# EAGLE design sensors (EAGLE 7.6.0)
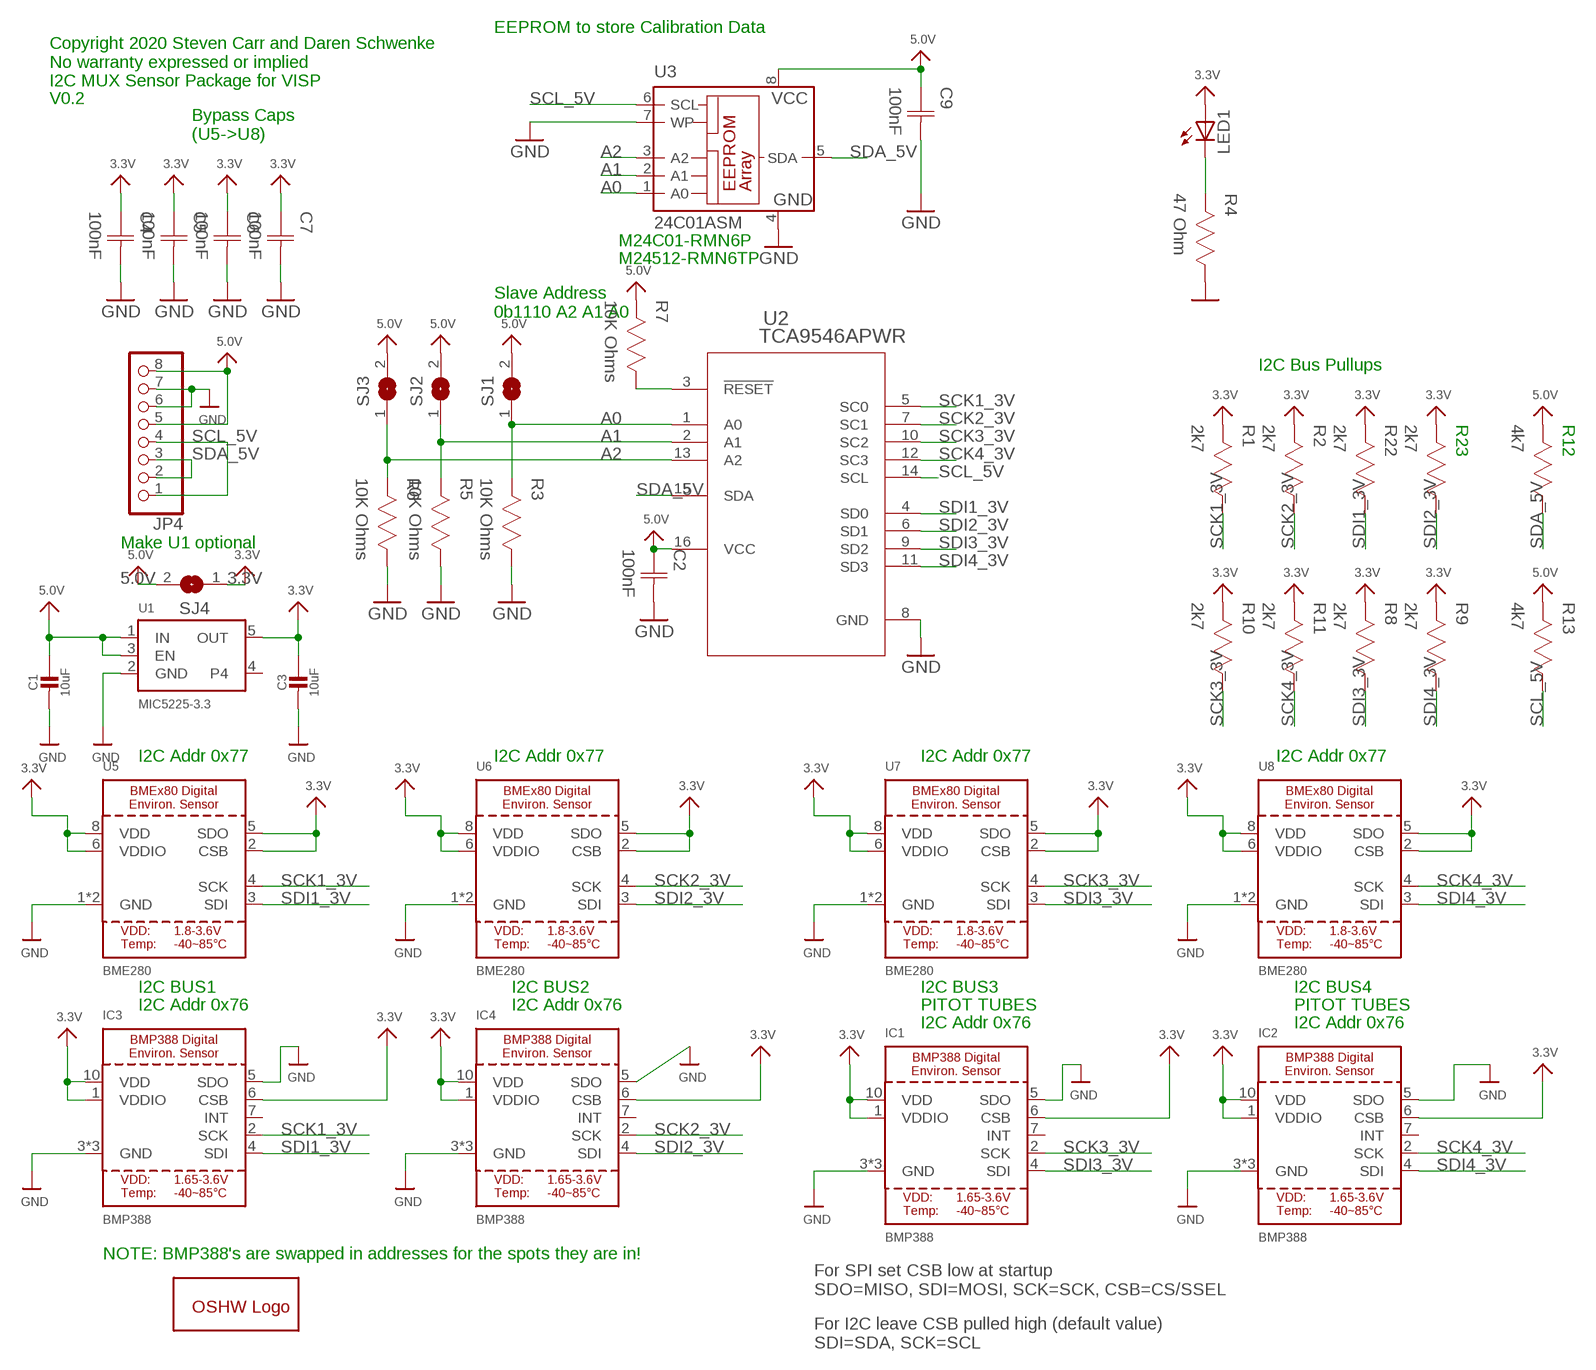
[diagram p0: schematic, sheet 1]

## Parts
C1  10uF  CAP_CERAMIC_0805  [_0805]
C2  100nF  CAPACITOR-0402  [CAP0402]
C3  10uF  CAP_CERAMIC_0805  [_0805]
C4  100nF  CAPACITOR-0402  [CAP0402]
C5  100nF  CAPACITOR-0402  [CAP0402]
C6  100nF  CAPACITOR-0402  [CAP0402]
C7  100nF  CAPACITOR-0402  [CAP0402]
C9  100nF  CAPACITOR-0402  [CAP0402]
GOLD_ORB_SM1  OSHWLOGOLOGO8MM  [OSHW_8MM]
IC1  BMP388  [BMP388]
IC2  BMP388  [BMP388]
IC3  BMP388  [BMP388]
IC4  BMP388  [BMP388]
JP4  PINHD-1X08_2.54  [1X08]
LED1  LEDCHIP-LED0603  [CHIP-LED0603]
R1  2k7  RESISTOR-0402  [RES0402]
R2  2k7  RESISTOR-0402  [RES0402]
R3  10K Ohms  RESISTOR-0402  [RES0402]
R4  47 Ohm  RESISTOR-0402  [RES0402]
R5  10K Ohms  RESISTOR-0402  [RES0402]
R6  10K Ohms  RESISTOR-0402  [RES0402]
R7  10K Ohms  RESISTOR-0402  [RES0402]
R8  2k7  RESISTOR-0402  [RES0402]
R9  2k7  RESISTOR-0402  [RES0402]
R10  2k7  RESISTOR-0402  [RES0402]
R11  2k7  RESISTOR-0402  [RES0402]
R12  4k7  RESISTOR-0402  [RES0402]
R13  4k7  RESISTOR-0402  [RES0402]
R22  2k7  RESISTOR-0402  [RES0402]
R23  2k7  RESISTOR-0402  [RES0402]
SJ1  SJ  [SJ]
SJ2  SJ  [SJ]
SJ3  SJ  [SJ]
SJ4  SJ  [SJ]
U1  MIC5225-3.3  VREG_SOT23-5  [SOT23-5]
U2  TCA9546APWR  [PW16]
U3  24C01ASM  [SO-08M]
U5  BME280  [BME280]
U6  BME280  [BME280]
U7  BME280  [BME280]
U8  BME280  [BME280]

## Nets
3.3V: C3.1 C4.1(C1) C5.1(C1) C6.1(C1) C7.1(C1) IC1.1(VDDIO) IC1.6(CSB) IC1.10(VDD) IC2.1(VDDIO) IC2.6(CSB) IC2.10(VDD) IC3.1(VDDIO) IC3.6(CSB) IC3.10(VDD) IC4.1(VDDIO) IC4.6(CSB) IC4.10(VDD) LED1.A R1.2 R2.2 R8.2 R9.2 R10.2 R11.2 R22.2 R23.2 SJ4.1 U1.5(OUT) U5.2(CSB) U5.5(SDO) U5.6(VDDIO) U5.8(VDD) U6.2(CSB) U6.5(SDO) U6.6(VDDIO) U6.8(VDD) U7.2(CSB) U7.5(SDO) U7.6(VDDIO) U7.8(VDD) U8.2(CSB) U8.5(SDO) U8.6(VDDIO) U8.8(VDD)
5.0V: C1.1 C2.1(C1) C9.1(C1) JP4.5 JP4.8 R7.2 R12.2 R13.2 SJ1.2 SJ2.2 SJ3.2 SJ4.2 U1.1(IN) U1.3(EN) U2.16(VCC) U3.8(VCC)
A0: R3.2 SJ1.1 U2.1(A0) U3.1(A0)
A1: R5.2 SJ2.1 U2.2(A1) U3.2(A1)
A2: R6.2 SJ3.1 U2.13(A2) U3.3(A2)
GND: C1.2 C2.2(C2) C3.2 C4.2(C2) C5.2(C2) C6.2(C2) C7.2(C2) C9.2(C2) IC1.3(GND) IC1.5(SDO) IC1.8(GND) IC1.9(GND) IC2.3(GND) IC2.5(SDO) IC2.8(GND) IC2.9(GND) IC3.3(GND) IC3.5(SDO) IC3.8(GND) IC3.9(GND) IC4.3(GND) IC4.5(SDO) IC4.8(GND) IC4.9(GND) JP4.6 JP4.7 R3.1 R4.1 R5.1 R6.1 U1.2(GND) U2.8(GND) U3.4(GND) U3.7(WP) U5.1(GND) U5.7(GND) U6.1(GND) U6.7(GND) U7.1(GND) U7.7(GND) U8.1(GND) U8.7(GND)
LED: LED1.C R4.2
RESET: R7.1 U2.3(!RESET)
SCK1_3V: IC3.2(SCK) R1.1 U2.5(SC0) U5.4(SCK)
SCK2_3V: IC4.2(SCK) R2.1 U2.7(SC1) U6.4(SCK)
SCK3_3V: IC1.2(SCK) R10.1 U2.10(SC2) U7.4(SCK)
SCK4_3V: IC2.2(SCK) R11.1 U2.12(SC3) U8.4(SCK)
SCL_5V: JP4.1 JP4.4 R13.1 U2.14(SCL) U3.6(SCL)
SDA_5V: JP4.2 JP4.3 R12.1 U2.15(SDA) U3.5(SDA)
SDI1_3V: IC3.4(SDI) R22.1 U2.4(SD0) U5.3(SDI)
SDI2_3V: IC4.4(SDI) R23.1 U2.6(SD1) U6.3(SDI)
SDI3_3V: IC1.4(SDI) R8.1 U2.9(SD2) U7.3(SDI)
SDI4_3V: IC2.4(SDI) R9.1 U2.11(SD3) U8.3(SDI)
Unconnected: IC1.7(INT) IC2.7(INT) IC3.7(INT) IC4.7(INT) U1.4

## Notes on the sheet
- EEPROM to store Calibration Data
- Copyright 2020 Steven Carr and Daren Schwenke
  No warranty expressed or implied
  I2C MUX Sensor Package for VISP
- V0.2
- Bypass Caps
  (U5->U8)
- M24C01-RMN6P
- M24512-RMN6TP
- Slave Address
  0b1110 A2 A1 A0
- I2C Bus Pullups
- Make U1 optional
- I2C Addr 0x77 | I2C Addr 0x77 | I2C Addr 0x77 | I2C Addr 0x77
- I2C BUS1 | I2C BUS2 | I2C BUS3 | I2C BUS4
- I2C Addr 0x76 | I2C Addr 0x76 | PITOT TUBES | PITOT TUBES
- I2C Addr 0x76 | I2C Addr 0x76
- NOTE: BMP388's are swapped in addresses for the spots they are in!
- For SPI set CSB low at startup
  SDO=MISO, SDI=MOSI, SCK=SCK, CSB=CS/SSEL
- For I2C leave CSB pulled high (default value)
  SDI=SDA, SCK=SCL

## Library data of the parts
C1 C3 = microbuilder:CAP_CERAMIC: Ceramic Capacitors For new designs, use the packages preceded by an '_' character since they are more reliable: The following footprints should be used on most boards: _0402 - Standard footprint for regular board layouts _0603 - Standard footprint for regular board layouts _0805 - Standard footprint for regular board layouts _1206 - Standard footprint for regular board layouts For extremely tight-pitch boards where space is at a premium, the following 'micro-pitch' footprints can be used (smaller pads, no silkscreen outline, etc.): _0402MP - Micro-pitch footprint for very dense/compact boards _0603MP - Micro-pitch footprint for very dense/compact boards _0805MP - Micro-pitch footprint for very dense/compact boards _1206MP - Micro-pitch footprint for very dense/compact boards; MPN: C1608X5R1A106M080AC
C2 C9 = Capacitor:CAPACITOR; MPN: CL10B104KB8NNNC
C4-C7 = Capacitor:CAPACITOR; MPN: CL10F104ZO8NNNC
GOLD_ORB_SM1 = oshw:OSHWLOGO: The OSHW logo for PCB layout
IC1-IC4 = microbuilder:BMP388; MPN: BMP388
JP4 = pinhead-2:PINHD-1X08: PIN HEADER
LED1 = led:LED: LED OSRAM: - CHIPLED LG R971, LG N971, LY N971, LG Q971, LY Q971, LO R971, LY R971 LH N974, LH R974 LS Q976, LO Q976, LY Q976 LO Q996 - Hyper CHIPLED LW Q18S LB Q993, LB Q99A, LB R99A - SideLED LS A670, LO A670, LY A670, LG A670, LP A670 LB A673, LV A673, LT A673, LW A673 LH A674 LY A675 LS A676, LA A676, LO A676, LY A676, LW A676 LS A679, LY A679, LG A679 - Hyper Micro SIDELED® LS Y876, LA Y876, LO Y876, LY Y876 LT Y87S - SmartLED LW L88C, LW L88S LB L89C, LB L89S, LG L890 LS L89K, LO L89K, LY L89K LS L896, LA L896, LO L896, LY L896 - TOPLED LS T670, LO T670, LY T670, LG T670, LP T670 LSG T670, LSP T670, LSY T670, LOP T670, LYG T670 LG T671, LOG T671, LSG T671 LB T673, LV T673, LT T673, LW T673 LH T674 LS T676, LA T676, LO T676, LY T676, LB T676, LH T676, LSB T676, LW T676 LB T67C, LV T67C, LT T67C, LS T67K, LO T67K, LY T67K, LW E67C LS E67B, LA E67B, LO E67B, LY E67B, LB E67C, LV E67C, LT E67C LW T67C LS T679, LY T679, LG T679 LS T770, LO T770, LY T770, LG T770, LP T770 LB T773, LV T773, LT T773, LW T773 LH T774 LS E675, LA E675, LY E675, LS T675 LS T776, LA T776, LO T776, LY T776, LB T776 LHGB T686 LT T68C, LB T68C - Hyper Mini TOPLED® LB M676 - Mini TOPLED Santana® LG M470 LS M47K, LO M47K, LY M47K Source: http://www.osram.convergy.de LUXEON: - LUMILED® LXK2-PW12-R00, LXK2-PW12-S00, LXK2-PW14-U00, LXK2-PW14-V00 LXK2-PM12-R00, LXK2-PM12-S00, LXK2-PM14-U00 LXK2-PE12-Q00, LXK2-PE12-R00, LXK2-PE12-S00, LXK2-PE14-T00, LXK2-PE14-U00 LXK2-PB12-K00, LXK2-PB12-L00, LXK2-PB12-M00, LXK2-PB14-N00, LXK2-PB14-P00, LXK2-PB14-Q00 LXK2-PR12-L00, LXK2-PR12-M00, LXK2-PR14-Q00, LXK2-PR14-R00 LXK2-PD12-Q00, LXK2-PD12-R00, LXK2-PD12-S00 LXK2-PH12-R00, LXK2-PH12-S00 LXK2-PL12-P00, LXK2-PL12-Q00, LXK2-PL12-R00 Source: www.luxeon.com KINGBRIGHT: KA-3528ASYC Source: www.kingbright.com; MPN: SML-D12P8WT86
R1-R3 R5-R13 R22 R23 = Resistor:RESISTOR; MPN: CRCW060310K0FKEAC
R4 = Resistor:RESISTOR; MPN: RC0603FR-0747RL
SJ1-SJ4 = jumper:SJ: SMD solder JUMPER
U1 = microbuilder:VREG_SOT23-5: SOT23-5 Fixed Voltage Regulators Part Current Out V Out V In V Dropout θJA (°C/W) TJ (°C) Digikey Part No. ADP121 150mA 3.3V 3.4-5.5V 0.09V @ 150mA -- -- ADP121-AUJZ33R7CT-ND ADP121 150mA 3.0V 3.1-5.5V 0.09V @ 150mA -- -- ADP121-AUJZ30R7CT-ND ADP122 300mA 3.3V 3.4-5.5V 0.085V @ 300mA -- -- ADP122AUJZ-3.3-R7CT-ND ADP1712 300mA 3.3V 3.5-5.5V 0.17V @ 300mA -- -- ADP1712AUJZ-3.3-R7TR-ND AP7311 (Low Cost) 150mA 3.3V 3.5-6V 0.15V @ 150mA -- -- AP7311-33WG-7DICT-ND LD39015M18R 150mA 1.8V 1.9V-5.5V 0.08V @ 100mA -- -- 497-6977-1-ND LP2985A-33DBVR 150mA 3.3V 3.3-16V 0.28V @ 150mA 206 150 296-18479-1-ND MCP1824T-3302E/OT 300mA 3.3V 3.5V-6V 0.2V @ 300mA -- -- MCP1824T-3302E/OTCT-ND MIC5205-2.5YM5 TR 150mA 2.5V 2.7-16V 0.165V @ 150mA -- -- 576-1257-2-ND MIC5205-3.0YM5 TR 150mA 3.0V 3.2V-16V 0.165V @ 150mA -- -- 576-1258-2-ND MIC5205-3.3YM5 TR 150mA 3.3V 3.5V-16V 0.165V @ 150mA -- -- 576-1259-2-ND TPS780330220 150mA 3.3V+2.2V 3.6-5.5V 250mV Max -- -- 296-23332-1-ND TDA3663/N1,135 100mA 3.3V 3.5-45V 0.18V @ 50mA -- -- 568-5343-1-ND Max operating temp can be calculated using θJA, TJ (max junction temperature), and power in watts. Set the "Maximum Ambient Temperature" until it reaches TJ ("Max Junction Temperature"), which is the absolute limit for safe use of the regulator: Heat Sink Temperature Calculator <http://www.daycounter.com/Calculators/Heat-Sink-Temperature-Calculator.phtml> For example, With 12V source into a 3.3V LP2985 and a 30mA load, we are dissipating (12V-3.3V) * 0.03A = 0.261W. With a θJA of 206 °C/W, a TJ of 150°C, and 261mW we can safely use the chip without a heat sink up to 75°C (=147.1°C Junction Temperature).; MPN: MIC5225-3.3YM5-TR
U2 = TCA9546A:TCA9546APWR; BUILT_BY: EMA_UL_Team; MANUFACTURER_PART_NUMBER: TCA9546APWR; VENDOR: Texas Instruments
U3 = microchip:24*: Serial EEPROM I2C; MF: MICROCHIP; MPN: M24C01-RMN6P
U5-U8 = microbuilder:BME280: BME280 - Environmental Sensor (I2C + SPI)

## Board
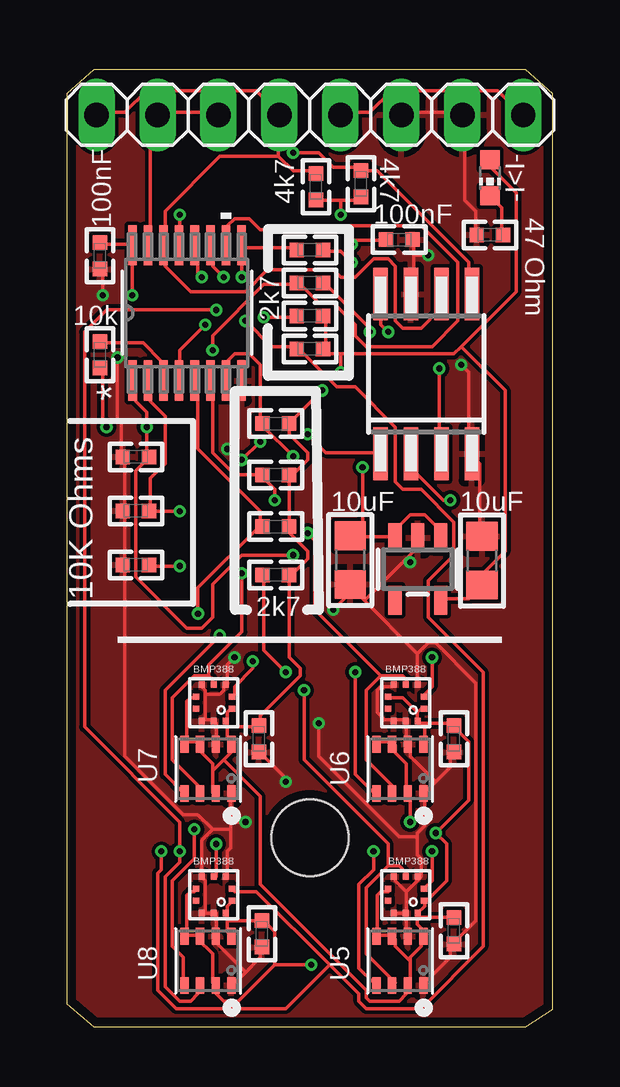
[diagram p1: board, top side]
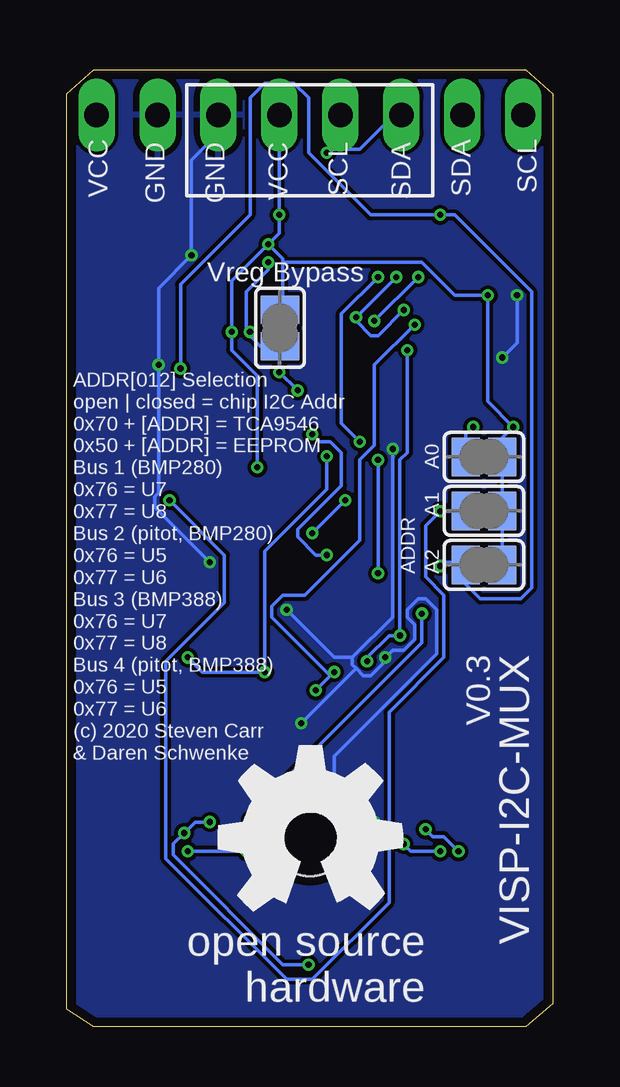
[diagram p2: board, bottom side, seen from below]

Size 20.25 x 39.88 mm. Coordinates in mm from the lower left corner, seen from the top.
Outline: 1.12,39.88 0,38.88 0,0.95 1.12,0 19.12,0 20.25,0.72 20.25,38.88 19.12,39.88 1.12,39.88
Copper layers (1*16): Top 0.035559375mm / dielectric 1.6mm / Bottom 0.035559375mm
Design rules "oshpark-2layer *": minimum track width 6mil, minimum drill 10mil, track to track 6mil, track to pad 6mil, pad to pad 6mil, via to via 6mil, smd to smd 6mil, copper to edge 15mil, drill to drill 6mil, minimum pad ring 6mil, minimum via ring 5mil, stop-mask expansion 2.5mil, vias tented up to drill 13mil, thermal gap 10mil
Holes 3.2 mm at 10.12,7.88
vRestrict: area 4.4,2.3 to 7.8,5.7; area 12.4,2.3 to 15.8,5.7; area 4.4,10.3 to 7.8,13.7; area 12.4,10.3 to 15.8,13.7

### Footprints (pad centres in the part's own frame; a part is rotated, then mirrored left to right if it is on the bottom)
_0805 = smd 1.2 x 1.3: 1 -1.016,0; 2 1.016,0
CAP0402 = smd 0.6 x 0.6: 1 -0.55,0; 2 0.55,0
BMP388 = smd 0.25 x 0.275: 1 0.25,0.75; 2 -0.25,0.75; 6 -0.25,-0.75; 7 0.25,-0.75 | smd 0.275 x 0.25: 3 -0.762,0.5; 4 -0.762,0; 5 -0.762,-0.5; 8 0.762,-0.5; 9 0.762,0; 10 0.762,0.5
1X08 = drill 1.016 long: 1 -8.89,0; 2 -6.35,0; 3 -3.81,0; 4 -1.27,0; 5 1.27,0; 6 3.81,0; 7 6.35,0; 8 8.89,0
CHIP-LED0603 = smd 0.8 x 0.8: A 0,-0.75; C 0,0.75
RES0402 = smd 0.6 x 0.6: 1 -0.55,0; 2 0.55,0
SJ = smd 1.168 x 1.6: 1 -0.762,0; 2 0.762,0
SOT23-5 = smd 0.55 x 1.2: 1 -0.95,-1.3; 2 0,-1.3; 3 0.95,-1.3; 4 0.95,1.3; 5 -0.95,1.3
PW16 = smd 1.676 x 0.356: 1 -2.819,2.275; 2 -2.819,1.625; 3 -2.819,0.975; 4 -2.819,0.325; 5 -2.819,-0.325; 6 -2.819,-0.975; 7 -2.819,-1.625; 8 -2.819,-2.275; 9 2.819,-2.275; 10 2.819,-1.625; 11 2.819,-0.975; 12 2.819,-0.325; 13 2.819,0.325; 14 2.819,0.975; 15 2.819,1.625; 16 2.819,2.275
SO-08M = smd 0.6 x 2.2: 1 -1.905,-3.33; 2 -0.635,-3.33; 3 0.635,-3.33; 4 1.905,-3.33; 5 1.905,3.33; 6 0.635,3.33; 7 -0.635,3.33; 8 -1.905,3.33
BME280 = smd 0.7 x 0.35: 1 1.025,0.975; 2 1.025,0.325; 3 1.025,-0.325; 4 1.025,-0.975; 5 -1.025,-0.975; 6 -1.025,-0.325; 7 -1.025,0.325; 8 -1.025,0.975

### Placement (x,y rotation side)
C1  11.8,19.45 270 top
C2  1.38,32.12 270 top
C3  17.3,19.43 90 top
C4  8,12 270 top
C5  16.12,4 270 top
C6  8.12,3.88 270 top
C7  16.12,12 270 top
C9  13.85,32.8 0 top
GOLD_ORB_SM1  10.12,7.88 0 bottom
IC1  6.12,13.5 270 top
IC2  6.12,5.5 270 top
IC3  14.12,5.5 270 top
IC4  14.12,13.5 270 top
JP4  10.12,38 0 top
LED1  17.62,35.38 180 top
R1  8.71,20.84 0 top
R2  8.71,25.14 0 top
R3  2.88,23.75 0 top
R4  17.62,33 0 top
R5  2.88,21.5 0 top
R6  2.88,19.25 0 top
R7  1.38,28 270 top
R8  10.12,32.38 0 top
R9  10.12,29.62 0 top
R10  10.12,31 0 top
R11  10.12,28.25 0 top
R12  12.25,35.12 270 top
R13  10.38,35 270 top
R22  8.71,18.83 0 top
R23  8.71,23 0 top
SJ1  2.88,23.75 0 bottom
SJ2  2.88,21.5 0 bottom
SJ3  2.88,19.25 0 bottom
SJ4  11.38,29.12 90 bottom
U1  14.62,19.07 180 top
U2  5,29.75 90 top
U3  14.97,27.2 0 top
U5  13.88,2.75 270 top
U6  13.88,10.75 270 top
U7  5.88,10.75 270 top
U8  5.88,2.75 270 top

### Tracks (layer width: path | path; a pad name or v marks a point on that pad's centre or on a via)
3.3V  (via drill 0.25)
  Top 0.152: v12.62,28.96 12.62,29.11 10.79,30.94 R10.2 | v11.86,31.85 11.4,32.31 10.79,32.31 R8.2 | U1.5 15.67,17.83 16.74,17.83 17.19,18.29 C3.1 17.35,18.44 17.35,18.9 18.26,19.81 18.26,26.52 16.43,28.35 | R9.2 10.79,29.57 10.79,28.35 R11.2 10.79,28.19 10.95,28.04 11.4,28.04 | 16.43,28.35 16.13,28.04 11.4,28.04 | 16.43,28.35 18.72,30.63 18.72,34.75 17.65,35.81 17.65,36.12 LED1.A | 11.4,28.04 v11.4,27.28 | 9.27,22.86 9.27,20.88 R1.2 9.12,20.73 10.03,19.81 10.03,19.51 9.42,18.9 9.27,18.9 R22.2 9.27,18.75 9.27,15.39 9.73,14.94 9.73,14.63 8.05,12.95 8.05,12.65 C4.1 7.9,12.5 6.68,12.5 | 9.27,22.86 10.03,23.62 10.03,23.93 9.27,24.69 9.27,24.99 R2.2 9.27,25.15 v10.64,26.52 | 9.27,22.86 R23.2 | IC1.1 6.83,13.26 6.68,13.11 6.68,12.8 IC1.10 6.68,12.65 6.68,12.5 | 6.68,12.5 6.68,12.04 6.83,11.89 U7.8 6.83,11.73 6.83,11.43 6.53,11.12 | 5,11.89 5,13.56 5.15,13.72 5.31,13.72 IC1.6 | 5,11.89 5.46,11.89 U7.6 5.61,11.73 5.61,11.43 6.07,10.97 6.07,10.67 | 5,11.89 U7.5 | 6.07,10.67 6.07,9.75 U7.2 | 6.07,10.67 6.53,11.12 | 6.68,4.72 6.68,5.03 6.83,5.18 IC2.1 | 6.68,4.42 6.68,3.96 6.83,3.81 U8.8 | 6.68,4.42 6.68,4.72 | 6.68,4.72 IC2.10 | 6.68,4.42 8.05,4.42 C6.1 8.2,4.42 8.66,3.96 8.66,2.59 | 5,3.81 5,5.49 5.15,5.64 5.31,5.64 IC2.6 | 5,3.81 5.46,3.81 U8.6 5.46,3.66 6.07,3.05 6.07,1.83 U8.2 6.22,1.68 6.22,1.37 6.53,1.07 7.13,1.07 8.66,2.59 | 5,3.81 U8.5 | 14.6,13.11 14.6,12.8 IC4.10 14.6,12.65 14.91,12.65 | 14.6,13.11 14.76,13.26 IC4.1 | 14.6,13.11 13.99,13.72 13.38,13.72 IC4.6 | 14.91,12.65 15.97,12.65 C7.1 16.13,12.5 16.74,11.89 16.74,9.45 v15.37,8.08 15.82,7.62 15.82,6.1 14.91,5.18 | 14.91,12.65 14.91,11.89 U6.8
  Top 0.152: U6.5 12.93,11.89 13.54,11.89 U6.6 13.69,11.73 13.69,11.43 14.15,10.97 14.15,9.75 U6.2 14.3,9.6 v14.3,8.53 | 12.93,3.81 12.93,5.49 13.08,5.64 13.38,5.64 IC3.6 | 12.93,3.81 13.54,3.81 U5.6 13.69,3.66 13.69,3.35 14.3,2.74 | 12.93,3.81 U5.5 | 14.6,4.72 14.91,5.03 14.91,5.18 | 14.6,4.57 14.6,4.27 14.76,4.12 14.76,3.81 U5.8 14.76,3.66 14.76,3.35 14.3,2.9 14.3,2.74 | 14.6,4.57 14.6,4.72 | 14.6,4.72 IC3.10 | 14.6,4.57 15.97,4.57 C5.1 | 14.3,2.74 14.3,1.83 U5.2 14.15,1.68 14.15,1.37 13.84,1.07 12.62,1.07 12.47,1.22 12.47,1.52 8.05,5.94 8.05,9.6 6.53,11.12 | 14.91,5.18 IC3.1 | v10.18,2.59 8.66,2.59
  Bottom 0.152: 11.4,28.35 12.16,28.35 12.62,28.8 v12.62,28.96 12.77,29.11 12.77,30.63 11.86,31.55 v11.86,31.85 | 11.4,28.35 v11.4,27.28 v10.64,26.52 | 11.4,28.35 SJ4.1 | v14.3,8.53 14.91,8.53 v15.37,8.08 15.82,7.62 15.82,7.16 11.25,2.59 v10.18,2.59
5.0V  (via drill 0.25)
  Top 0.152: C2.1 1.5,32.61 2.72,32.61 U2.16 2.72,32.46 v2.72,30.48 | v1.65,24.99 1.5,25.15 1.5,27.43 R7.2 | JP4.5 11.4,38.1 12.62,38.1 13.54,39.01 17.96,39.01 18.87,38.1 JP4.8 | 12.32,20.42 11.86,20.42 C1.1 12.32,20.42 | 12.32,20.42 13.38,20.42 | 13.38,20.42 13.54,20.42 U1.3 | 13.38,20.42 14.3,21.34 14.91,21.34 15.52,20.73 15.52,20.42 U1.1 | 11.4,34.44 12.16,34.44 R12.2 | 11.4,34.44 10.49,34.44 R13.2 | v11.86,32.61 12.01,32.77 13.23,32.77 C9.1 | v11.4,33.83 11.4,34.44 | v13.38,28.96 13.08,29.26 13.08,30.48 U3.8 | v12.32,23.32 12.32,20.42
  Bottom 0.152: SJ3.2 2.11,19.36 2.11,21.49 SJ2.2 2.11,21.64 2.11,23.62 SJ1.2 2.11,23.77 2.11,24.54 v1.65,24.99 2.72,26.06 v2.72,30.48 4.09,30.48 5.46,31.85 11.25,31.85 | v11.86,32.61 11.25,32 11.25,31.85 | 11.25,31.85 11.25,30.02 SJ4.2 | v11.86,32.61 11.4,33.07 v11.4,33.83 11.4,36.73 11.25,36.88 11.25,37.95 JP4.5 | v11.86,32.61 13.38,31.09 v13.38,28.96 13.38,28.19 12.32,27.13 v12.32,23.32
A0  (via drill 0.25)
  Top 0.152: U2.1 2.87,26.82 2.87,26.06 3.33,25.6 v3.33,24.99 3.33,23.77 R3.2 3.33,23.62 2.87,23.16 2.87,18.75 5,16.61 5.61,16.61 6.07,17.07 6.07,18.44 7.29,19.66 v9.42,19.66 | v10.03,24.69 10.79,23.93 12.93,23.93 U3.1
  Bottom 0.152: v3.33,24.99 3.63,24.69 3.63,23.77 SJ1.1 | v10.03,24.69 9.73,24.38 9.27,24.38 8.81,23.93 8.81,22.55 10.64,20.73 10.64,20.42 9.88,19.66 v9.42,19.66
A1  (via drill 0.25)
  Top 0.152: U2.2 3.48,26.82 3.48,26.06 4.09,25.45 4.09,23.47 3.48,22.86 3.48,21.64 R5.2 3.48,21.49 v4.7,21.49 | v15.97,21.95 15.67,21.95 14.45,23.16 14.45,23.77 U3.2
  Bottom 0.152: SJ2.1 3.78,21.49 v4.7,21.49 5.31,20.88 5.31,18.75 4.54,17.98 4.54,15.39 6.83,13.11 6.83,5.18 10.03,1.98 11.1,1.98 16.13,7.01 16.13,15.24 13.69,17.68 13.69,19.66 v15.97,21.95
A2  (via drill 0.25)
  Top 0.152: v4.7,19.2 3.48,19.2 R6.2 | v4.7,33.83 4.7,32.61 U2.13 | v15.52,27.43 15.52,23.93 U3.3
  Bottom 0.152: v4.7,19.2 4.54,19.36 3.78,19.36 SJ3.1 3.63,19.2 3.63,18.44 3.02,17.83 1.34,17.83 0.89,18.29 0.89,30.63 4.09,33.83 v4.7,33.83 7.59,33.83 10.18,36.42 10.18,38.71 10.79,39.32 12.01,39.32 12.62,38.71 12.62,33.83 15.52,30.94 v15.52,27.43
GND  (via drill 0.25)
  Top 0.152: R4.1 17.04,33.07 17.04,33.98 16.58,34.44 16.58,37.95 JP4.7 16.43,38.1 13.99,38.1 JP4.6 | C3.2 17.19,20.57 17.19,23.47 16.89,23.77 U3.4 16.74,23.93 16.74,27.28 v16.43,27.58 | 14.45,32.16 14.45,30.63 U3.7 | 14.45,32.16 14.45,32.77 C9.2 | v15.06,32.16 14.45,32.16 | U5.1 14.91,1.83 15.97,2.9 15.97,3.35 C5.2 16.13,3.5 17.04,4.42 17.04,14.33 15.37,16 15.06,16 14.6,15.54 | 14.6,15.54 14.6,14.33 IC4.3 | 12.32,17.83 11.86,18.29 C1.2 11.71,18.29 11.71,17.98 v11.1,17.37 | 12.32,17.83 14.6,15.54 | 14.15,19.51 12.47,17.83 12.32,17.83 | 14.15,19.51 14.6,19.96 14.6,20.27 U1.2 | v1.5,30.48 1.5,31.55 C2.2 | v2.11,27.89 2.11,25.3 2.26,25.15 2.26,23.77 R3.1 2.41,23.62 2.41,21.64 R5.1 2.41,21.49 2.41,19.36 R6.1 2.41,19.2 2.41,11.28 4.85,8.84 5.46,8.84 6.07,8.23 | IC4.5 13.54,14.17 13.08,14.17 12.93,14.02 12.93,13.11 13.23,12.8 13.54,12.8 IC4.8 13.69,12.8 14.15,12.8 IC4.9 14.15,12.65 14.15,11.89 U6.7 14.3,11.73 14.3,11.28 15.37,10.21 | 14.15,4.72 13.69,4.72 IC3.8 | 14.15,4.72 14.15,3.81 U5.7 | 14.15,5.64 13.69,6.1 13.69,6.25 IC3.5 | 14.76,6.25 14.15,5.64 | 14.76,6.25 14.76,7.01 14.6,7.16 14.6,7.92 | 14.6,7.92 14.6,8.08 14.91,8.38 14.91,9.6 U6.1 14.91,9.75 15.37,10.21 | 14.76,6.25 14.6,6.25 IC3.3 | 15.37,10.21 15.97,10.82 15.97,11.43 C7.2 | 14.15,5.64 14.15,4.72 | 14.15,4.72 IC3.9 | 5.76,4.72 6.07,4.72 IC2.9 6.22,4.72 6.22,3.81 U8.7 6.22,3.66 6.22,3.5 7.44,2.29 | 5.76,4.72 5.61,4.72 IC2.8 | 5.61,6.25 5.76,6.1 5.76,4.72 | 7.44,2.29 6.98,1.83 U8.1 | 7.44,2.29 8.05,2.9 8.05,3.2 C6.2 | 5.76,12.8 6.07,12.8 IC1.9 6.22,12.65 6.22,11.89 U7.7 | 5.76,12.8 5.61,12.8 IC1.8 | 5.76,12.8 5.76,13.87 | 5.76,13.87 5.76,14.02 5.61,14.17 IC1.5
  Top 0.152: 5.76,13.87 6.37,13.87 6.53,14.02 6.53,14.17 IC1.3 6.68,14.33 6.68,15.09 v6.98,15.39 | 6.83,8.53 6.83,9.6 U7.1 | 6.83,8.53 6.83,8.23 | 6.83,8.23 6.83,7.47 6.68,7.32 6.68,6.25 IC2.3 | v9.12,10.21 9.12,10.36 8.05,11.43 C4.2 | 6.83,8.53 v7.44,8.53 | v6.68,24.08 7.13,24.54 7.13,26.82 U2.8 | 5.61,6.25 5.61,7.77 6.07,8.23 | 6.83,8.23 6.07,8.23 | 5.61,6.25 IC2.5 | 14.6,7.92 13.84,7.92 10.49,11.28 v10.49,12.65 | 14.15,19.51 v14.3,19.36
  Bottom 0.152: JP4.6 13.99,37.95 13.99,37.34 14.15,37.19 14.15,37.03 15.06,36.12 v15.06,32.16 16.43,30.79 v16.43,27.58 16.43,22.25 16.58,22.1 16.58,21.64 v14.3,19.36 | v1.5,30.48 1.5,28.5 v2.11,27.89 | v7.44,8.53 v9.12,10.21 9.12,11.28 4.85,15.54 4.85,17.37 5.31,17.83 5.61,17.83 6.07,17.37 6.07,17.07 5.76,16.76 5.76,16.15 6.22,15.7 6.68,15.7 v6.98,15.39 6.98,15.24 7.59,14.63 7.9,14.63 8.2,14.94 | v6.68,24.08 6.68,17.07 8.36,15.39 | 8.36,15.39 8.36,15.09 8.2,14.94 | 8.2,14.94 v10.49,12.65 | v11.1,17.37 9.12,15.39 8.36,15.39
  pour Top: 0.12,38.88 1,39.75 19.12,39.75 20.12,38.75 20.12,0.62 19.38,-0.12 1,-0.12 0.12,0.75
  pour Bottom: 0.12,38.88 1,39.75 19.12,39.75 20.12,38.75 20.12,0.62 19.38,-0.12 1,-0.12 0.12,0.75
LED
  Top 0.152: R4.2 18.11,33.07 18.11,34.14 17.65,34.59 LED1.C
RESET
  Top 0.152: R7.1 1.5,28.5 3.17,28.5 3.94,27.74 3.94,26.98 U2.3
SCK1_3V  (via drill 0.25)
  Top 0.152: v15.21,7.32 15.21,6.1 14.91,5.79 IC3.2 | v12.77,7.32 12.77,6.55 12.16,5.94 12.16,2.44 12.77,1.83 U5.4 | 8.05,20.88 8.05,21.49 5.46,24.08 5.46,26.82 U2.5 | v5.46,17.22 5.46,18.29 8.05,20.88 | 8.05,20.88 R1.1
  Bottom 0.152: v15.21,7.32 v12.77,7.32 12.77,8.69 5.46,16 v5.46,17.22
SCK2_3V  (via drill 0.25)
  Top 0.152: U2.7 6.68,26.98 6.68,27.74 6.98,28.04 7.59,28.04 8.05,27.58 8.05,25.15 R2.1 8.2,24.99 v9.42,23.77 | v15.21,15.39 15.21,14.17 14.91,13.87 IC4.2 | v12.01,14.78 12.01,10.52 12.77,9.75 U6.4
  Bottom 0.152: v15.21,15.39 14.6,14.78 v12.01,14.78 12.01,19.81 9.42,22.4 v9.42,23.77
SCK3_3V  (via drill 0.25)
  Top 0.152: v7.75,15.24 7.75,14.94 6.98,14.17 6.98,13.87 IC1.2 | v6.37,16.31 4.09,14.02 4.09,10.52 4.85,9.75 U7.4 | U2.10 6.68,32.61 6.68,33.38 6.98,33.68 7.59,33.68 8.05,33.22 11.55,33.22 11.71,33.38 14.76,33.38 16.28,31.85 16.28,29.41 15.21,28.35 12.47,28.35 12.01,28.8 12.01,29.26 11.1,30.18 10.49,30.18 9.73,30.94 R10.1 9.57,30.94 8.2,30.94 6.07,28.8 v6.07,28.19
  Bottom 0.152: v7.75,15.24 7.75,15.39 6.83,16.31 v6.37,16.31 6.37,23.62 6.07,23.93 v6.07,28.19
SCK4_3V  (via drill 0.25)
  Top 0.152: 10.95,2.59 12.16,1.37 12.16,1.07 12.47,0.76 14.76,0.76 17.35,3.35 17.35,14.78 15.06,17.07 15.06,18.59 16.13,19.66 16.13,21.03 14.76,22.4 13.99,22.4 13.69,22.71 13.69,24.99 12.01,26.67 11.25,26.67 9.73,28.19 R11.1 9.57,28.35 8.51,28.35 v7.44,29.41 | 10.95,2.59 7.9,5.64 6.98,5.64 IC2.2 | v5.31,8.23 5.31,7.01 4.39,6.1 4.39,3.35 4.85,2.9 4.85,1.83 U8.4 | v3.94,7.32 3.94,6.55 3.78,6.4 3.78,1.52 4.54,0.76 9.12,0.76 10.95,2.59 | v5.61,31.24 5.46,31.39 5.46,32.46 U2.12
  Bottom 0.152: v5.31,8.23 5,7.92 4.54,7.92 v3.94,7.32 | v7.44,29.41 v5.61,31.24
SCL_5V
  Top 0.152: 8.81,36.27 9.42,35.66 10.34,35.66 R13.1 | 8.81,36.27 8.81,37.95 JP4.4 8.81,38.1 7.9,39.01 3.33,39.01 2.41,38.1 1.34,38.1 JP4.1 | 8.81,36.27 6.37,36.27 4.09,33.98 4.09,32.61 U2.14 4.09,32.46 4.09,31.7 5.15,30.63 7.44,30.63 8.36,31.55 11.1,31.55 11.4,31.24 12.01,31.24 12.77,32 13.38,32 13.69,31.7 13.69,29.41 13.99,29.11 14.76,29.11 15.52,29.87 15.52,30.48 U3.6
SDA_5V  (via drill 0.25)
  Top 0.152: U3.5 16.74,30.63 16.74,31.85 12.93,35.66 12.32,35.66 R12.1 12.16,35.81 11.1,35.81 10.49,36.42 v9.42,36.42 | U2.15 3.48,32.61 3.48,37.8 3.63,37.95 JP4.2 3.78,38.1 6.22,38.1 JP4.3
  Bottom 0.152: v9.42,36.42 9.27,36.58 8.05,36.58 6.68,37.95 6.37,37.95 JP4.3
SDI1_3V  (via drill 0.25)
  Top 0.152: 13.38,6.71 13.84,6.71 14.15,6.4 14.15,6.25 IC3.4 | 13.38,6.71 12.47,5.79 12.47,3.05 13.69,1.83 U5.3 | v9.12,14.78 8.2,15.7 8.2,18.75 R22.1 | v9.88,14.02 9.88,11.12 13.38,7.62 13.38,6.71 | v5.76,29.26 4.7,28.19 4.7,26.98 U2.4
  Bottom 0.152: v9.88,14.02 9.27,14.63 | v5.76,29.26 7.44,27.58 7.44,24.23 8.05,23.62 8.05,20.27 10.34,17.98 11.25,17.98 11.71,17.53 11.71,17.07 9.27,14.63 | 9.27,14.63 v9.12,14.78
SDI2_3V  (via drill 0.25)
  Top 0.152: 13.08,14.63 13.99,14.63 14.15,14.48 14.15,14.33 IC4.4 | 13.08,14.63 12.47,14.02 12.47,11.12 13.54,10.06 13.54,9.75 U6.3 | U2.6 6.07,26.82 6.07,23.93 6.98,23.01 8.05,23.01 R23.1 8.2,22.86 8.66,22.4 v8.66,21.95 | 13.08,14.63 10.34,17.37 10.34,20.27 v10.03,20.57
  Bottom 0.152: v8.66,21.95 v10.03,20.57
SDI3_3V  (via drill 0.25)
  Top 0.152: 7.29,32.46 9.57,32.46 R8.1 | 5.92,14.63 6.07,14.48 6.07,14.33 IC1.4 | 5.92,14.63 5.31,14.63 4.39,13.72 4.39,11.12 5.46,10.06 5.46,9.75 U7.3 | v7.29,31.24 7.29,32.46 | v7.29,23.62 v8.05,24.38 | v7.29,18.9 7.29,16.46 5.92,15.09 5.92,14.63 | 7.29,32.46 U2.9
  Bottom 0.152: v7.29,31.24 8.81,29.72 8.81,25.15 v8.05,24.38 | v7.29,18.9 v7.29,23.62
SDI4_3V  (via drill 0.25)
  Top 0.152: v6.22,7.62 6.22,6.25 IC2.4 | U8.3 5.46,1.68 5.46,1.37 5.15,1.07 4.7,1.07 4.09,1.68 4.09,6.25 4.7,6.86 v4.7,7.32 4.7,8.53 0.73,12.5 0.73,28.96 1.65,29.87 v6.22,29.87 | v8.2,29.57 9.57,29.57 R9.1 | v6.53,31.24 6.07,31.7 6.07,32.46 U2.11
  Bottom 0.152: v6.22,7.62 5.92,7.32 v4.7,7.32 | v6.53,31.24 v8.2,29.57 8.2,29.41 7.59,28.8 7.29,28.8 v6.22,29.87

### Text on the board
tNames: -I<I- | 10k | 10uF | 10uF | 2k7 | BMP388 | BMP388 | BMP388 | BMP388
bNames: SCL | SDA | SDA | SCL | VCC | GND | GND | VCC | Vreg Bypass | A0 | A1 | A2 | ADDR | VISP-I2C-MUX | V0.3 | ADDR[012] Selection / open | closed = chip I2C Addr / 0x70 + [ADDR] = TCA9546 / 0x50 + [ADDR] = EEPROM / Bus 1 (BMP280) / 0x76 = U7 / 0x77 = U8 / Bus 2 (pitot, BMP280) / 0x76 = U5 / 0x77 = U6 / Bus 3 (BMP388) / 0x76 = U7 / 0x77 = U8 / Bus 4 (pitot, BMP388) / 0x76 = U5 / 0x77 = U6 / (c) 2020 Steven Carr / & Daren Schwenke
tValues: *